# Altium project S7CAS-PLEIADES-CARTE-MERE_Pxx.PrjPcb (part 3 of 5)

## Sheet S7CAS-PLEIADES-CARTE-MERE_Pxx_CAN.SchDoc
size Tabloid; SheetNumber: 12; SheetTotal: 18; Sheet_Name: CAN; Size: 11x17
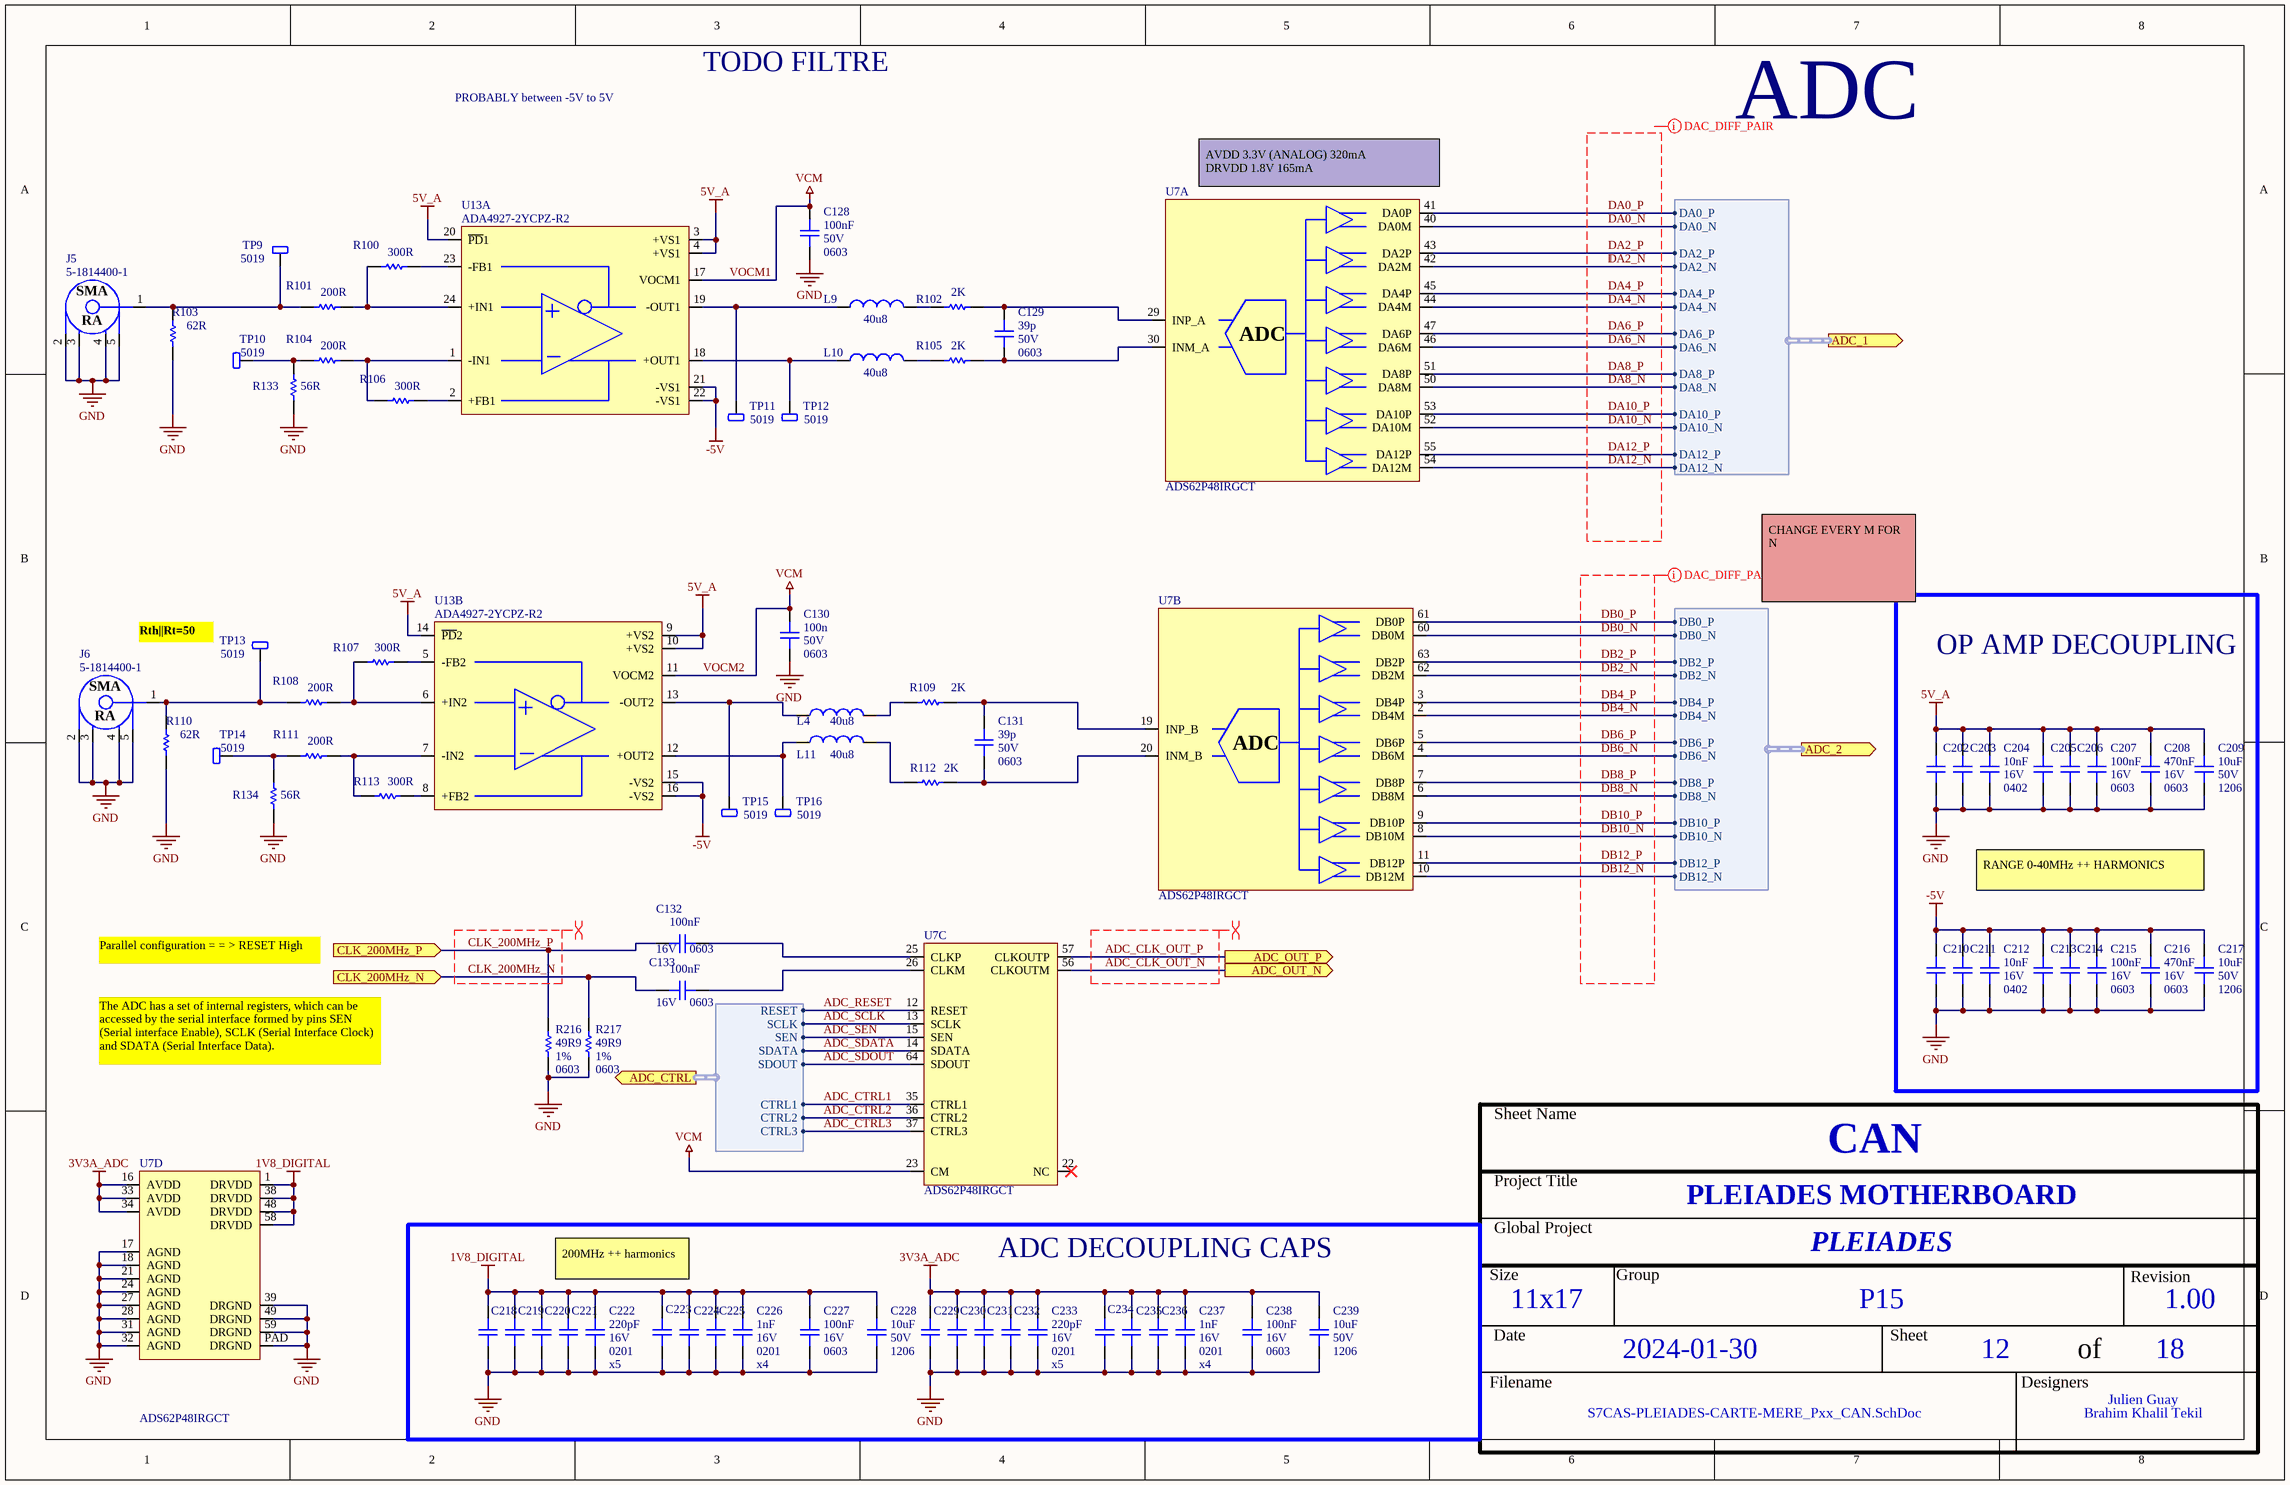
[diagram p10: S7CAS-PLEIADES-CARTE-MERE_Pxx_CAN.SchDoc]

### Parts
C128  value 100nF  Voltage: 50V  Package: 0603  [CAP_0603]  (hidden comment: CAP - 0603)
C129  value 39p  Voltage: 50V  Package: 0603  [CAP_0603]  (hidden comment: CAP - 0603)
C130  value 100n  Voltage: 50V  Package: 0603  [CAP_0603]  (hidden comment: CAP - 0603)
C131  value 39p  Voltage: 50V  Package: 0603  [CAP_0603]  (hidden comment: CAP - 0603)
C132  value 100nF  Voltage: 16V  Package: 0603  [CAP_0603]  (hidden comment: CAP - 0603)
C133  value 100nF  Voltage: 16V  Package: 0603  [CAP_0603]  (hidden comment: CAP - 0603)
C202  CAP - 0402  [CAP_0402]  (value not drawn)
C203  CAP - 0402  [CAP_0402]  (value not drawn)
C204  value 10nF  Voltage: 16V  Package: 0402  [CAP_0402]  (hidden comment: CAP - 0402)
C205  CAP - 0603  [CAP_0603]  (value not drawn)
C206  CAP - 0603  [CAP_0603]  (value not drawn)
C207  value 100nF  Voltage: 16V  Package: 0603  [CAP_0603]  (hidden comment: CAP - 0603)
C208  value 470nF  Voltage: 16V  Package: 0603  [CAP_0603]  (hidden comment: CAP - 0603)
C209  value 10uF  Voltage: 50V  Package: 1206  [CAP_1206]  (hidden comment: CAP - 1206)
C210  CAP - 0402  [CAP_0402]  (value not drawn)
C211  CAP - 0402  [CAP_0402]  (value not drawn)
C212  value 10nF  Voltage: 16V  Package: 0402  [CAP_0402]  (hidden comment: CAP - 0402)
C213  CAP - 0603  [CAP_0603]  (value not drawn)
C214  CAP - 0603  [CAP_0603]  (value not drawn)
C215  value 100nF  Voltage: 16V  Package: 0603  [CAP_0603]  (hidden comment: CAP - 0603)
C216  value 470nF  Voltage: 16V  Package: 0603  [CAP_0603]  (hidden comment: CAP - 0603)
C217  value 10uF  Voltage: 50V  Package: 1206  [CAP_1206]  (hidden comment: CAP - 1206)
C218  CAP - 0201  [CAP_0201]  (value not drawn)
C219  CAP - 0201  [CAP_0201]  (value not drawn)
C220  CAP - 0201  [CAP_0201]  (value not drawn)
C221  CAP - 0201  [CAP_0201]  (value not drawn)
C222  value 220pF  Voltage: 16V  Package: 0201  [CAP_0201]  (hidden comment: CAP - 0201)
C223  CAP - 0201  [CAP_0201]  (value not drawn)
C224  CAP - 0201  [CAP_0201]  (value not drawn)
C225  CAP - 0201  [CAP_0201]  (value not drawn)
C226  value 1nF  Voltage: 16V  Package: 0201  [CAP_0201]  (hidden comment: CAP - 0201)
C227  value 100nF  Voltage: 16V  Package: 0603  [CAP_0603]  (hidden comment: CAP - 0603)
C228  value 10uF  Voltage: 50V  Package: 1206  [CAP_1206]  (hidden comment: CAP - 1206)
C229  CAP - 0201  [CAP_0201]  (value not drawn)
C230  CAP - 0201  [CAP_0201]  (value not drawn)
C231  CAP - 0201  [CAP_0201]  (value not drawn)
C232  CAP - 0201  [CAP_0201]  (value not drawn)
C233  value 220pF  Voltage: 16V  Package: 0201  [CAP_0201]  (hidden comment: CAP - 0201)
C234  CAP - 0201  [CAP_0201]  (value not drawn)
C235  CAP - 0201  [CAP_0201]  (value not drawn)
C236  CAP - 0201  [CAP_0201]  (value not drawn)
C237  value 1nF  Voltage: 16V  Package: 0201  [CAP_0201]  (hidden comment: CAP - 0201)
C238  value 100nF  Voltage: 16V  Package: 0603  [CAP_0603]  (hidden comment: CAP - 0603)
C239  value 10uF  Voltage: 50V  Package: 1206  [CAP_1206]  (hidden comment: CAP - 1206)
J5  5-1814400-1  [CONN_SMA_5-1814400-1]
J6  5-1814400-1  [CONN_SMA_5-1814400-1]
L4  value 40u8  [INDUCT_0603]  (hidden comment: INDUCTOR - 0603)
L9  value 40u8  [INDUCT_0603]  (hidden comment: INDUCTOR - 0603)
L10  value 40u8  [INDUCT_0603]  (hidden comment: INDUCTOR - 0603)
L11  value 40u8  [INDUCT_0603]  (hidden comment: INDUCTOR - 0603)
R100  value 300R  [RES_0603]  (hidden comment: RES - 0603)
R101  value 200R  [RES_0603]  (hidden comment: RES - 0603)
R102  value 2K  [RES_0603]  (hidden comment: RES - 0603)
R103  value 62R  [RES_0603]  (hidden comment: RES - 0603)
R104  value 200R  [RES_0603]  (hidden comment: RES - 0603)
R105  value 2K  [RES_0603]  (hidden comment: RES - 0603)
R106  value 300R  [RES_0603]  (hidden comment: RES - 0603)
R107  value 300R  [RES_0603]  (hidden comment: RES - 0603)
R108  value 200R  [RES_0603]  (hidden comment: RES - 0603)
R109  value 2K  [RES_0603]  (hidden comment: RES - 0603)
R110  value 62R  [RES_0603]  (hidden comment: RES - 0603)
R111  value 200R  [RES_0603]  (hidden comment: RES - 0603)
R112  value 2K  [RES_0603]  (hidden comment: RES - 0603)
R113  value 300R  [RES_0603]  (hidden comment: RES - 0603)
R133  value 56R  [RES_0603]  (hidden comment: RES - 0603)
R134  value 56R  [RES_0603]  (hidden comment: RES - 0603)
R216  value 49R9  Package: 0603  Precision: 1%  [RES_0603]  (hidden comment: RES - 0603)
R217  value 49R9  Package: 0603  Precision: 1%  [RES_0603]  (hidden comment: RES - 0603)
TP9  5019  [TPO_SMD_5019]
TP10  5019  [TPO_SMD_5019]
TP11  5019  [TPO_SMD_5019]
TP12  5019  [TPO_SMD_5019]
TP13  5019  [TPO_SMD_5019]
TP14  5019  [TPO_SMD_5019]
TP15  5019  [TPO_SMD_5019]
TP16  5019  [TPO_SMD_5019]
U7  ADS62P48IRGCT  [ADC_ADS62P48IRGCT]  (parts A,B,C,D of 4)
U13  ADA4927-2YCPZ-R2  [OPAMP_ADA4927-2YCPZ-R2]  (parts A,B of 2)

### Blocks framed on the sheet
OP AMP DECOUPLING: C202-C217
ADC DECOUPLING CAPS: C218-C239

### Ports
ADC_1 (out, harness ADC_1_HARNESS, see S7CAS-PLEIADES-CARTE-MERE_Pxx_FPGA_bank3[1A]), ADC_2 (out, harness ADC_2_HARNESS, see S7CAS-PLEIADES-CARTE-MERE_Pxx_FPGA_bank3[1B]), ADC_CTRL (out, harness ADC_CTRL_HARNESS, see S7CAS-PLEIADES-CARTE-MERE_Pxx_FPGA_bank3[2C]), ADC_OUT_N (out, see S7CAS-PLEIADES-CARTE-MERE_Pxx_FPGA_bank3[4B]), ADC_OUT_P (out, see S7CAS-PLEIADES-CARTE-MERE_Pxx_FPGA_bank3[4B]), CLK_200MHz_N (in, see S7CAS-PLEIADES-CARTE-MERE_Pxx_FLASH_PHY_CLOCK[5A]), CLK_200MHz_P (in, see S7CAS-PLEIADES-CARTE-MERE_Pxx_FLASH_PHY_CLOCK[5A])

### Harnesses
ADC_1_HARNESS: DA0_P, DA0_N, DA2_P, DA2_N, DA4_P, DA4_N, DA6_P, DA6_N, DA8_P, DA8_N, DA10_P, DA10_N, DA12_P, DA12_N
ADC_2_HARNESS: DB0_P, DB0_N, DB2_P, DB2_N, DB4_P, DB4_N, DB6_P, DB6_N, DB8_P, DB8_N, DB10_P, DB10_N, DB12_P, DB12_N
ADC_CTRL_HARNESS: RESET, SCLK, SEN, SDATA, SDOUT, CTRL1, CTRL2, CTRL3

### Nets
1V8_DIGITAL: C218.2 C219.2 C220.2 C221.2 C222.2 C223.2 C224.2 C225.2 C226.2 C227.2 C228.2 U7.1(DRVDD) U7.38(DRVDD) U7.48(DRVDD) U7.58(DRVDD)
3V3A_ADC: C229.2 C230.2 C231.2 C232.2 C233.2 C234.2 C235.2 C236.2 C237.2 C238.2 C239.2 U7.16(AVDD) U7.33(AVDD) U7.34(AVDD)
5V_A: C202.2 C203.2 C204.2 C205.2 C206.2 C207.2 C208.2 C209.2 U13.3(+VS1) U13.4(+VS1) U13.9(+VS2) U13.10(+VS2) U13.14(~{PD}2) U13.20(~{PD}1)
-5V: C210.2 C211.2 C212.2 C213.2 C214.2 C215.2 C216.2 C217.2 U13.15(-VS2) U13.16(-VS2) U13.21(-VS1) U13.22(-VS1)
GND: C128.1 C130.1 C202.1 C203.1 C204.1 C205.1 C206.1 C207.1 C208.1 C209.1 C210.1 C211.1 C212.1 C213.1 C214.1 C215.1 C216.1 C217.1 C218.1 C219.1 C220.1 C221.1 C222.1 C223.1 C224.1 C225.1 C226.1 C227.1 C228.1 C229.1 C230.1 C231.1 C232.1 C233.1 C234.1 C235.1 C236.1 C237.1 C238.1 C239.1 J5.2 J5.3 J5.4 J5.5 J6.2 J6.3 J6.4 J6.5 R103.1 R110.1 R133.2 R134.2 R216.1 R217.1 U7.17(AGND) U7.18(AGND) U7.21(AGND) U7.24(AGND) U7.27(AGND) U7.28(AGND) U7.31(AGND) U7.32(AGND) U7.39(DRGND) U7.49(DRGND) U7.59(DRGND) U7.PAD(DRGND)  [project net nCS]
VOCM1: C128.2 C130.2 U7.23(CM) U13.11(VOCM2) U13.17(VOCM1)  [also labelled VCM, VOCM2]
: U7.42(DA2M) ; port ADC_1.DA2_N  [also labelled DA2_N]
ADC_CLK_OUT_N: U7.56(CLKOUTM) ; port ADC_OUT_N
ADC_CLK_OUT_P: U7.57(CLKOUTP) ; port ADC_OUT_P
ADC_CTRL1: U7.35(CTRL1) ; port ADC_CTRL.CTRL1
ADC_CTRL2: U7.36(CTRL2) ; port ADC_CTRL.CTRL2
ADC_CTRL3: U7.37(CTRL3) ; port ADC_CTRL.CTRL3
ADC_RESET: U7.12(RESET) ; port ADC_CTRL.RESET
ADC_SCLK: U7.13(SCLK) ; port ADC_CTRL.SCLK
ADC_SDATA: U7.14(SDATA) ; port ADC_CTRL.SDATA
ADC_SDOUT: U7.64(SDOUT) ; port ADC_CTRL.SDOUT
ADC_SEN: U7.15(SEN) ; port ADC_CTRL.SEN
CLK_200MHz_N: C133.2 R217.2 ; port CLK_200MHz_N
CLK_200MHz_P: C132.2 R216.2 ; port CLK_200MHz_P
DA0_N: U7.40(DA0M) ; port ADC_1.DA0_N
DA0_P: U7.41(DA0P) ; port ADC_1.DA0_P
DA2_P: U7.43(DA2P) ; port ADC_1.DA2_P
DA4_N: U7.44(DA4M) ; port ADC_1.DA4_N
DA4_P: U7.45(DA4P) ; port ADC_1.DA4_P
DA6_N: U7.46(DA6M) ; port ADC_1.DA6_N
DA6_P: U7.47(DA6P) ; port ADC_1.DA6_P
DA8_N: U7.50(DA8M) ; port ADC_1.DA8_N
DA8_P: U7.51(DA8P) ; port ADC_1.DA8_P
DA10_N: U7.52(DA10M) ; port ADC_1.DA10_N
DA10_P: U7.53(DA10P) ; port ADC_1.DA10_P
DA12_N: U7.54(DA12M) ; port ADC_1.DA12_N
DA12_P: U7.55(DA12P) ; port ADC_1.DA12_P
DB0_N: U7.60(DB0M) ; port ADC_2.DB0_N
DB0_P: U7.61(DB0P) ; port ADC_2.DB0_P
DB2_N: U7.62(DB2M) ; port ADC_2.DB2_N
DB2_P: U7.63(DB2P) ; port ADC_2.DB2_P
DB4_N: U7.2(DB4M) ; port ADC_2.DB4_N
DB4_P: U7.3(DB4P) ; port ADC_2.DB4_P
DB6_N: U7.4(DB6M) ; port ADC_2.DB6_N
DB6_P: U7.5(DB6P) ; port ADC_2.DB6_P
DB8_N: U7.6(DB8M) ; port ADC_2.DB8_N
DB8_P: U7.7(DB8P) ; port ADC_2.DB8_P
DB10_N: U7.8(DB10M) ; port ADC_2.DB10_N
DB10_P: U7.9(DB10P) ; port ADC_2.DB10_P
DB12_N: U7.10(DB12M) ; port ADC_2.DB12_N
DB12_P: U7.11(DB12P) ; port ADC_2.DB12_P
NetC129_1: C129.1 R105.1 U7.30(INM_A)
NetC129_2: C129.2 R102.1 U7.29(INP_A)
NetC131_1: C131.1 R112.1 U7.20(INM_B)
NetC131_2: C131.2 R109.1 U7.19(INP_B)
NetC132_1: C132.1 U7.25(CLKP)
NetC133_1: C133.1 U7.26(CLKM)
NetJ5_1: J5.1 R101.2 R103.2 TP9.1
NetJ6_1: J6.1 R108.2 R110.2 TP13.1
NetL4_1: L4.1 TP15.1 U13.13(-OUT2)
NetL4_2: L4.2 R109.2
NetL9_1: L9.1 TP11.1 U13.19(-OUT1)
NetL9_2: L9.2 R102.2
NetL10_1: L10.1 TP12.1 U13.18(+OUT1)
NetL10_2: L10.2 R105.2
NetL11_1: L11.1 TP16.1 U13.12(+OUT2)
NetL11_2: L11.2 R112.2
NetR100_1: R100.1 U13.23(-FB1)
NetR100_2: R100.2 R101.1 U13.24(+IN1)
NetR104_1: R104.1 R106.2 U13.1(-IN1)
NetR104_2: R104.2 R133.1 TP10.1
NetR106_1: R106.1 U13.2(+FB1)
NetR107_1: R107.1 U13.5(-FB2)
NetR107_2: R107.2 R108.1 U13.6(+IN2)
NetR111_1: R111.1 R113.2 U13.7(-IN2)
NetR111_2: R111.2 R134.1 TP14.1
NetR113_1: R113.1 U13.8(+FB2)

Not connected (* = marked no-connect by the designer): U7 22(NC)*

### Layout directives
differential pair: (no net found under the mark), ADC_CLK_OUT_N, ADC_CLK_OUT_P, CLK_200MHz_N, CLK_200MHz_P, DB0_N, DB0_P, DB2_N, DB2_P, DB4_N, DB4_P, DB6_N, DB6_P, DB8_N, DB8_P, DB10_N, DB10_P, DB12_N, DB12_P

### Notes on the sheet
- TODO FILTRE
- PROBABLY between -5V to 5V
- ADC
- (near U7) AVDD 3.3V (ANALOG) 320mA
  DRVDD 1.8V 165mA
- CHANGE EVERY M FOR N
- Rth||Rt=50
- RANGE 0-40MHz ++ HARMONICS
- Parallel configuration = = > RESET High
- The ADC has a set of internal registers, which can be accessed by the serial interface formed by pins SEN
  (Serial interface Enable), SCLK (Serial Interface Clock) and SDATA (Serial Interface Data).
- 200MHz ++ harmonics
- (near C222) x5
- (near C226) x4
- (near C233) x5
- (near C237) x4
- Sheet Name
- Project Title
- Global Project
- Size
- Group
- Revision
- Date
- Sheet
- of
- Filename
- Designers
- (in symbol ADC_ADS62P48IRGCT, part A) ADC
- (in symbol ADC_ADS62P48IRGCT, part B) ADC
- (in symbol CONN_SMA_5-1814400-1) SMA; RA

### Library data of the parts
C128-C133 C207 C208 C215 C216 C227 C238 = CAP - 0603: Precision: 10%; Current: *; CreatedBy: Jonathan Bouchard; Power: *
  C132 C133 C207 C215 C227 C238: Supplier 1: Arrow Electronics; Supplier Part Number 1: CL10B104KO8NNNC
  C208 C216: Supplier 1: Arrow Electronics; Supplier Part Number 1: C1608X7R1C474K080AC
C202 C203 C210 C211 = CAP - 0402: Precision: 10%; Voltage: 16V; Value: 10nF; Current: *; CreatedBy: Jonathan Bouchard; Power: *; Package: 0402; Supplier 1: Arrow Electronics; Supplier Part Number 1: GRM155R61A224KE19D
C204 C212 = CAP - 0402: Precision: 10%; Current: *; CreatedBy: Jonathan Bouchard; Power: *; Supplier 1: Arrow Electronics; Supplier Part Number 1: GRM155R61A224KE19D
C205 C206 C213 C214 = CAP - 0603: Precision: 10%; Voltage: 16V; Value: 100nF; Current: *; CreatedBy: Jonathan Bouchard; Power: *; Package: 0603; Supplier 1: Arrow Electronics; Supplier Part Number 1: CL10B104KO8NNNC
C209 C217 C228 C239 = CAP - 1206: Precision: 10%; Current: *; CreatedBy: Jonathan Bouchard; Power: *; Supplier 1: Avnet; Supplier Part Number 1: CL31A106MBHNNNE
C218-C221 C229-C232 = CAP - 0201: Precision: 10%; Voltage: 16V; Value: 220pF; Current: *; CreatedBy: Jonathan Bouchard; Power: *; Package: 0201; Supplier 1: Arrow Electronics; Supplier Part Number 1: GRM033R71C221KA01D
C222 C226 C233 C237 = CAP - 0201: Precision: 10%; Current: *; CreatedBy: Jonathan Bouchard; Power: *
  C222 C233: Supplier 1: Arrow Electronics; Supplier Part Number 1: GRM033R71C221KA01D
  C226 C237: Supplier 1: Avnet; Supplier Part Number 1: GRM033R71C102KA01J
C223-C225 C234-C236 = CAP - 0201: Precision: 10%; Voltage: 16V; Value: 1nF; Current: *; CreatedBy: Jonathan Bouchard; Power: *; Package: 0201; Supplier 1: Avnet; Supplier Part Number 1: GRM033R71C102KA01J
J5 J6 = CONN_SMA_5-1814400-1: CONN -  SMA JACK R/A 50 OHM - TH; Mfg: TE Connectivity AMP Connectors; Voltage: *; Current: *; Power: *; Mfg Part Number: 5-1814400-1; HelpURL: http://www.te.com/commerce/DocumentDelivery/DDEController?Action=srchrtrv&DocNm=1814400&DocType=Customer+Drawing&DocLang=English; CreatedBy: Jonathan Bouchard; Temperature: -55°C ~ 85°C; Value: *; Precision: *; Package: TH-5; Supplier 1: Digikey; Supplier Part Number 1: A97593-ND
L4 L9-L11 = INDUCT - 0603: GRAMS Lib Spec: 2.7; Saturation Val: *
TP9-TP16 = TPO_SMD_5019: TPO - PC TEST POINT MINI - SMD; Manufacturer #1: Keystone Electronics; Value: 3.81mm x 2.03mm; Polarized: No; Magnetic Material: UNKNOWN; GRAMS Lib Spec: 2.8; Current Rating: *; Manufacturer #2: *; Note: *; Power Max: *; Part Number #2: *; HelpURL: https://www.digikey.ca/product-detail/en/keystone-electronics/5019/36-5019CT-ND/3907344; Supplier 1: Digi-Key; Supplier Part Number 1: 36-5019CT-ND; Assembly Type: SMD; Part Number #1: 5019; Package: SMD; CreatedBy/Date: Olivier Bernard / 5/12/2017; Temperature: *; Tolerance: *; VerifiedBy: Caroline Paulin / 5 juillet 2018; Voltage Rating: *; Cryo: UNKNOWN
U7 = ADC_ADS62P48IRGCT: ADC - 14 BIT 210MSPS SUAL - VQFN-64; Voltage: 3.15 V ~ 3.6 V / 1.7 V ~ 1.9 V; Mfg: Texas Instruments; Precision: 14 Bit; Current: *; Power: *; Mfg Part Number: ADS62P48IRGCT; HelpURL: http://www.ti.com/lit/ds/symlink/ads62p48.pdf; CreatedBy: Jonathan Bouchard; Temperature: -40°C ~ 85°C; Value: *; Package: VQFN-64; Supplier 1: Digikey; Supplier Part Number 1: 296-24611-1-ND
U13 = OPAMP_ADA4927-2YCPZ-R2: OPAMP - CFA 2.3GHZ - QFN-24; Voltage: 4.5 V ~ 11 V, ±2.25 V ~ 5.5 V; Current: 65mA; Mfg: Analog Devices; Power: *; Mfg Part Number: ADA4927-2YCPZ-R2; HelpURL: http://www.analog.com/media/en/technical-documentation/data-sheets/ADA4927-1_4927-2.pdf; CreatedBy: Jonathan Bouchard; Temperature: -40°C ~ 105°C; Value: *; Precision: *; Package: QFN-24; Supplier 1: Digikey; Supplier Part Number 1: ADA4927-2YCPZ-R2CT-ND
R100-R113 R133 R134 R216 R217 = RES - 0603: Current: *; CreatedBy: Jonathan Bouchard
  R216 R217: Supplier 1: Mouser; Supplier Part Number 1: 667-ERJ-3EKF49R9V

## Sheet S7CAS-PLEIADES-CARTE-MERE_Pxx_MOTEUR.SchDoc
size Tabloid; SheetNumber: 13; SheetTotal: 18; Sheet_Name: MOTEUR; Size: 11x17
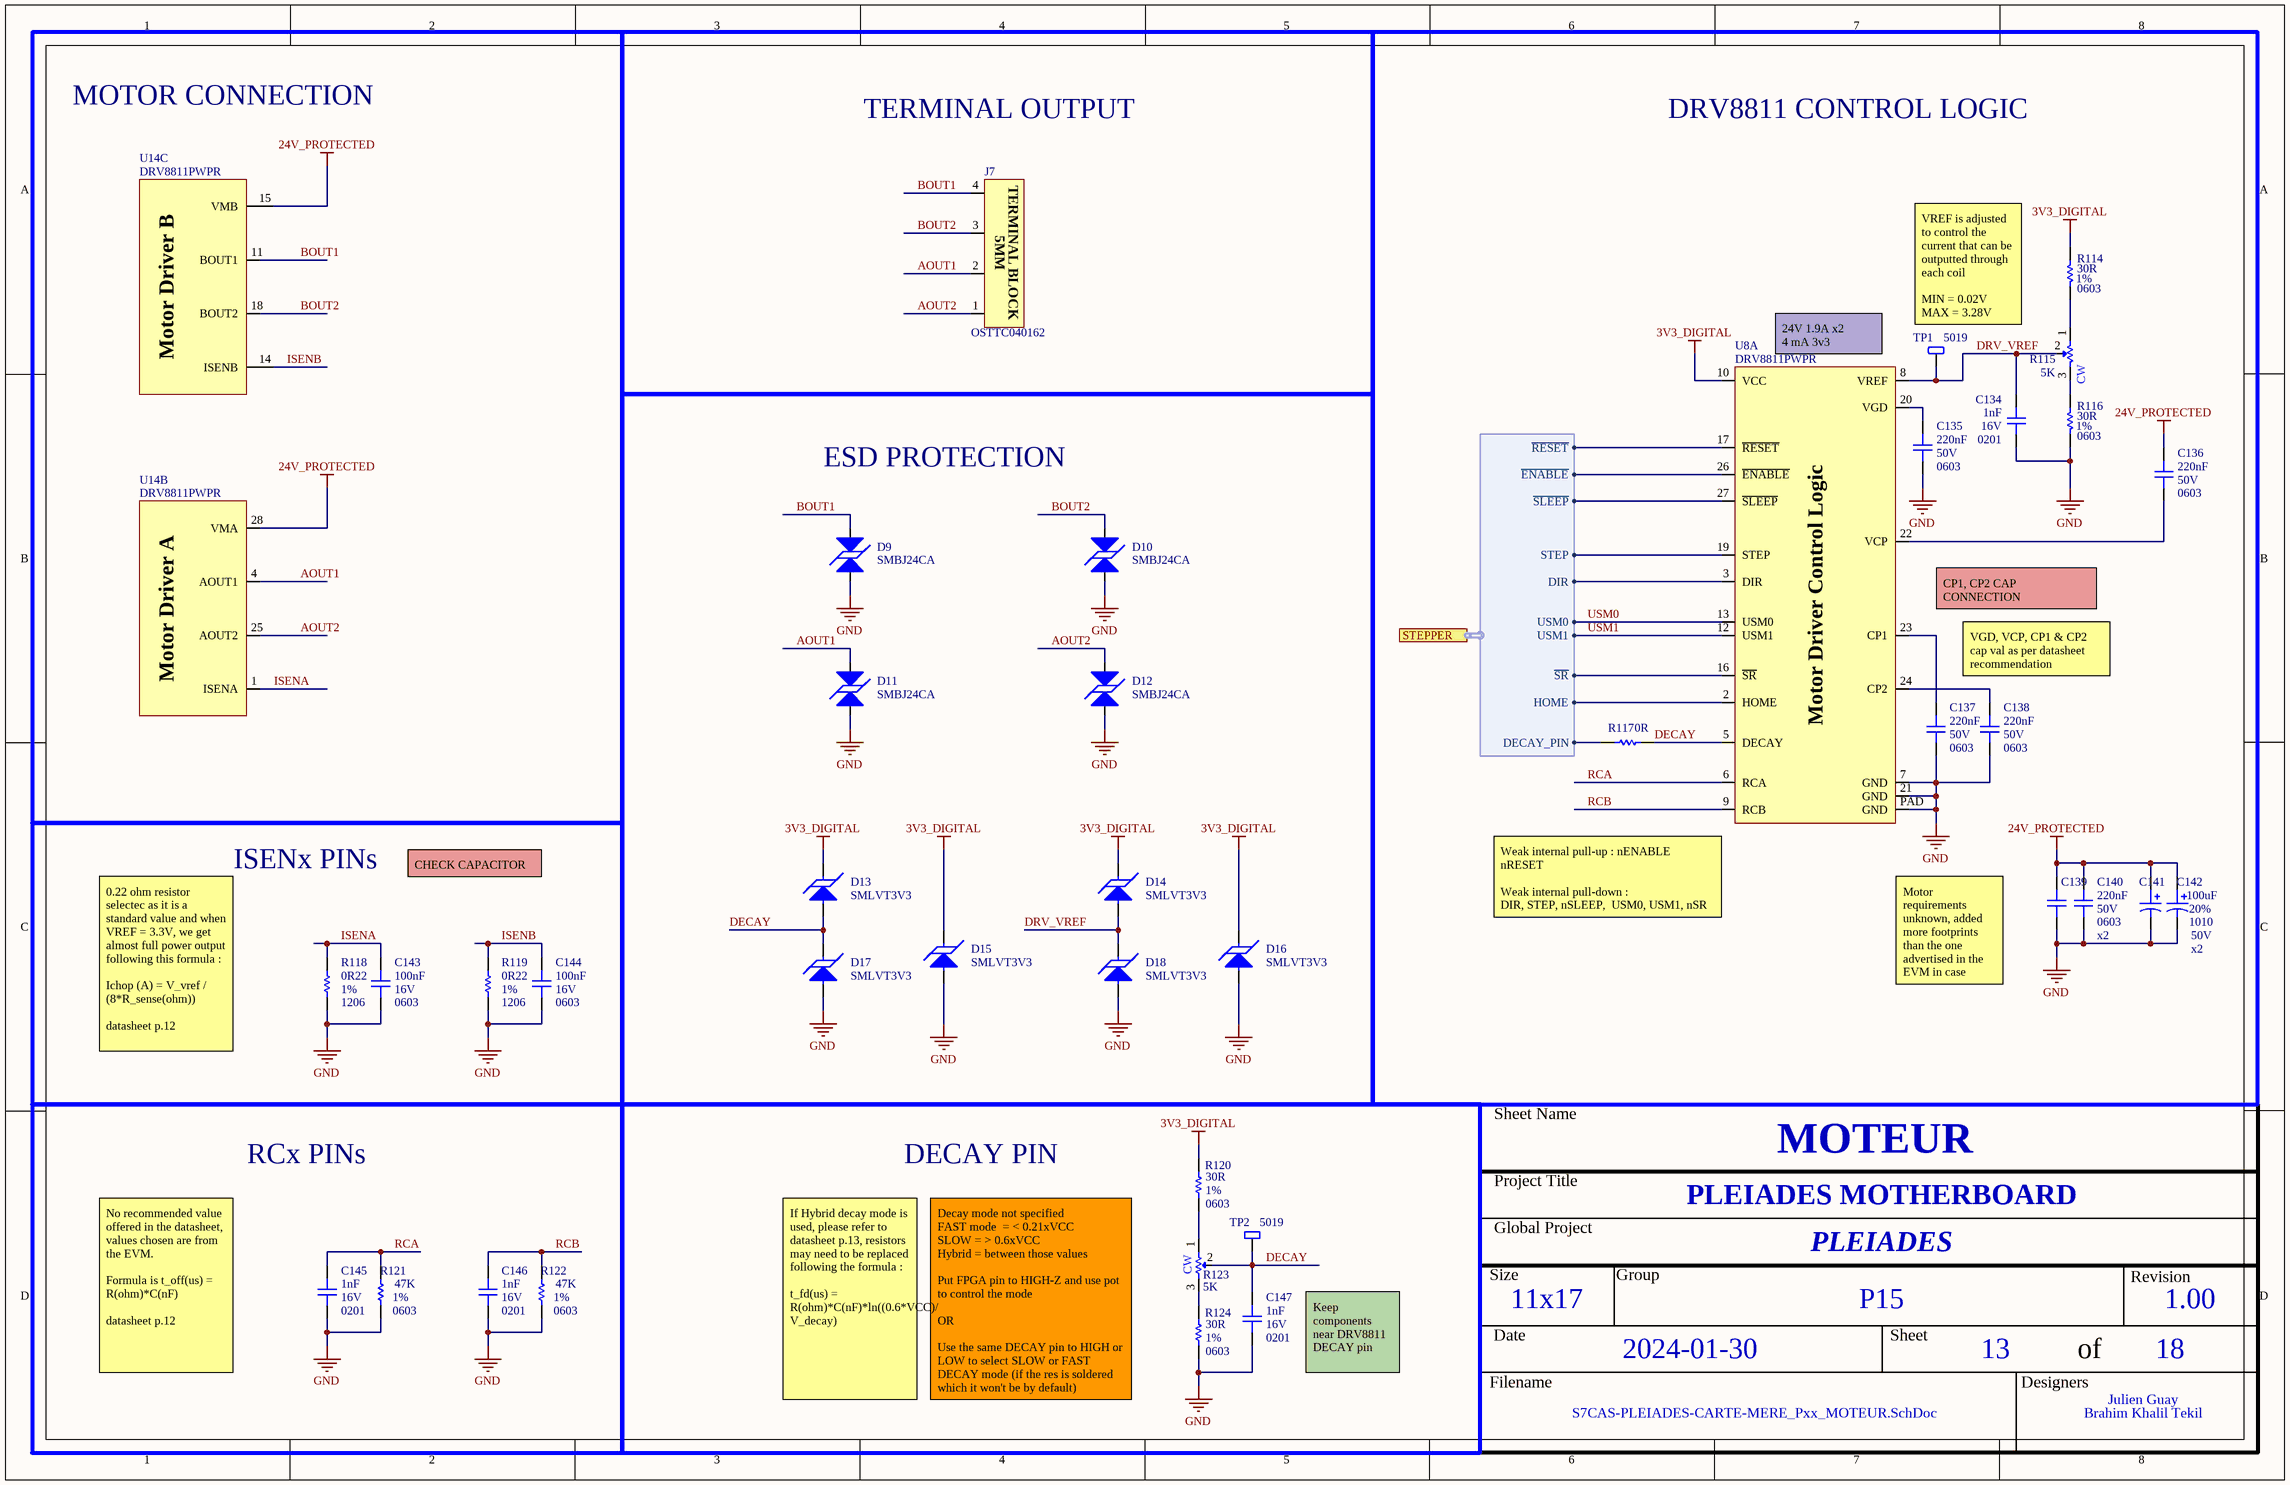
[diagram p11: S7CAS-PLEIADES-CARTE-MERE_Pxx_MOTEUR.SchDoc]

### Parts
C134  value 1nF  Voltage: 16V  Package: 0201  [CAP_0201]  (hidden comment: CAP - 0201)
C135  value 220nF  Voltage: 50V  Package: 0603  [CAP_0603]  (hidden comment: CAP - 0603)
C136  value 220nF  Voltage: 50V  Package: 0603  [CAP_0603]  (hidden comment: CAP - 0603)
C137  value 220nF  Voltage: 50V  Package: 0603  [CAP_0603]  (hidden comment: CAP - 0603)
C138  value 220nF  Voltage: 50V  Package: 0603  [CAP_0603]  (hidden comment: CAP - 0603)
C139  CAP - 0603  [CAP_0603]  (value not drawn)
C140  value 220nF  Voltage: 50V  Package: 0603  [CAP_0603]  (hidden comment: CAP - 0603)
C141  MAL215099101E3  [CAP_ALU_1010_vishay]  (value not drawn)
C142  value 100uF  Voltage: 50V  Package: 1010  Precision: 20%  [CAP_ALU_1010_vishay]  (hidden comment: MAL215099101E3)
C143  value 100nF  Voltage: 16V  Package: 0603  [CAP_0603]  (hidden comment: CAP - 0603)
C144  value 100nF  Voltage: 16V  Package: 0603  [CAP_0603]  (hidden comment: CAP - 0603)
C145  value 1nF  Voltage: 16V  Package: 0201  [CAP_0201]  (hidden comment: CAP - 0201)
C146  value 1nF  Voltage: 16V  Package: 0201  [CAP_0201]  (hidden comment: CAP - 0201)
C147  value 1nF  Voltage: 16V  Package: 0201  [CAP_0201]  (hidden comment: CAP - 0201)
D9  SMBJ24CA  [TVS_PWR_SMBJ36CA]
D10  SMBJ24CA  [TVS_PWR_SMBJ36CA]
D11  SMBJ24CA  [TVS_PWR_SMBJ36CA]
D12  SMBJ24CA  [TVS_PWR_SMBJ36CA]
D13  SMLVT3V3  [TVS_POW_SMLVT3V3]
D14  SMLVT3V3  [TVS_POW_SMLVT3V3]
D15  SMLVT3V3  [TVS_POW_SMLVT3V3]
D16  SMLVT3V3  [TVS_POW_SMLVT3V3]
D17  SMLVT3V3  [TVS_POW_SMLVT3V3]
D18  SMLVT3V3  [TVS_POW_SMLVT3V3]
J7  OSTTC040162  [CONN_TERMINAL_OSTTA040161]
R114  value 30R  Package: 0603  Precision: 1%  [RES_0603]  (hidden comment: RES - 0603)
R115  value 5K  [POT_J_LEAD_TOP]  (hidden comment: Part Number)
R116  value 30R  Package: 0603  Precision: 1%  [RES_0603]  (hidden comment: RES - 0603)
R117  value 0R  [RES_0603]  (hidden comment: RES - 0603)
R118  value 0R22  Package: 1206  Precision: 1%  [RES_1206]  (hidden comment: RES - 1206)
R119  value 0R22  Package: 1206  Precision: 1%  [RES_1206]  (hidden comment: RES - 1206)
R120  value 30R  Package: 0603  Precision: 1%  [RES_0603]  (hidden comment: RES - 0603)
R121  value 47K  Package: 0603  Precision: 1%  [RES_0603]  (hidden comment: RES - 0603)
R122  value 47K  Package: 0603  Precision: 1%  [RES_0603]  (hidden comment: RES - 0603)
R123  value 5K  [POT_J_LEAD_TOP]  (hidden comment: Part Number)
R124  value 30R  Package: 0603  Precision: 1%  [RES_0603]  (hidden comment: RES - 0603)
TP1  5019  [TPO_SMD_5019]
TP2  5019  [TPO_SMD_5019]
U8  DRV8811PWPR  [POW_MOTOR_DRV8811PWPR]  (part A of 3)
U14  DRV8811PWPR  [POW_MOTOR_DRV8811PWPR]  (parts B,C of 3)

### Blocks framed on the sheet
MOTOR CONNECTION: U14
TERMINAL OUTPUT: J7
DRV8811 CONTROL LOGIC: C134-C142 R114-R117 TP1 U8
ESD PROTECTION: D9-D18
ISENx PINs: C143 C144 R118 R119
RCx PINs: C145 C146 R121 R122
DECAY PIN: C147 R120 R123 R124 TP2

### Ports
STEPPER (harness STEPPER_MOTOR_DRIVER_HARNESS, see S7CAS-PLEIADES-CARTE-MERE_Pxx_FPGA_bank0_1_5[1A])

### Harnesses
STEPPER_MOTOR_DRIVER_HARNESS: ~{RESET}, ~{ENABLE}, ~{SLEEP}, STEP, DIR, USM0, USM1, ~{SR}, HOME, DECAY_PIN

### Nets
3V3_DIGITAL: D13.K D14.K D15.K D16.K R114.1 R120.1 U8.10(VCC)
24V_PROTECTED: C136.2 C139.2 C140.2 C141.1 C142.1 U14.15(VMB) U14.28(VMA)
GND: C134.1 C135.1 C137.1 C138.1 C139.1 C140.1 C141.2 C142.2 C143.1 C144.1 C145.1 C146.1 C147.1 D9.2 D10.2 D11.2 D12.2 D15.A D16.A D17.A D18.A R116.2 R118.1 R119.1 R121.1 R122.1 R124.2 U8.7(GND) U8.21(GND) U8.PAD(GND)  [project net nCS]
AOUT1: D11.1 J7.2 U14.4(AOUT1)
AOUT2: D12.1 J7.1 U14.25(AOUT2)
BOUT1: D9.1 J7.4 U14.11(BOUT1)
BOUT2: D10.1 J7.3 U14.18(BOUT2)
DECAY: C147.2 D13.A D17.K R117.1 R123.2 TP2.1 U8.5(DECAY)
DRV_VREF: C134.2 D14.A D18.K R115.2 TP1.1 U8.8(VREF)
ISENA: C143.2 R118.2 U14.1(ISENA)
ISENB: C144.2 R119.2 U14.14(ISENB)
RCA: C145.2 R121.2 U8.6(RCA)
RCB: C146.2 R122.2 U8.9(RCB)
USM0: U8.13(USM0) ; port STEPPER.USM0
USM1: U8.12(USM1) ; port STEPPER.USM1
NetC135_2: C135.2 U8.20(VGD)
NetC136_1: C136.1 U8.22(VCP)
NetC137_2: C137.2 U8.23(CP1)
NetC138_2: C138.2 U8.24(CP2)
NetR114_2: R114.2 R115.1
NetR115_3: R115.3 R116.1
NetR117_2: R117.2 ; port STEPPER.DECAY_PIN
NetR120_2: R120.2 R123.1
NetR123_3: R123.3 R124.1
NetU1_A5: U8.19(STEP) ; port STEPPER.STEP
NetU1_A6: U8.16(~{SR}) ; port STEPPER.~{SR}
NetU1_C5: U8.27(~{SLEEP}) ; port STEPPER.~{SLEEP}
NetU1_C7: U8.2(HOME) ; port STEPPER.HOME
NetU1_D5: U8.26(~{ENABLE}) ; port STEPPER.~{ENABLE}
NetU1_E6: U8.17(~{RESET}) ; port STEPPER.~{RESET}
NetU1_G8: U8.3(DIR) ; port STEPPER.DIR

### Notes on the sheet
- (near U8) 24V 1.9A x2
  4 mA 3v3
- VREF is adjusted to control the current that can be outputted through each coil
  MIN = 0.02V
  MAX = 3.28V
- (near U8) CP1, CP2 CAP CONNECTION
- VGD, VCP, CP1 & CP2 cap val as per datasheet recommendation
- CHECK CAPACITOR
- (near U8) Weak internal pull-up : nENABLE nRESET
  Weak internal pull-down :
  DIR, STEP, nSLEEP,  USM0, USM1, nSR
- (near C140) x2
- x2
- Motor requirements unknown, added more footprints than the one advertised in the EVM in case needed
- 0.22 ohm resistor selectec as it is a standard value and when VREF = 3.3V, we get almost full power output following this formula :
  Ichop (A) = V_vref / (8*R_sense(ohm))
  datasheet p.12
- No recommended value offered in the datasheet, values chosen are from the EVM.
  Formula is t_off(us) = R(ohm)*C(nF)
  datasheet p.12
- Keep components near DRV8811 DECAY pin
- If Hybrid decay mode is used, please refer to datasheet p.13, resistors may need to be replaced following the formula :
  t_fd(us) = R(ohm)*C(nF)*ln((0.6*VCC)/ V_decay)
- Decay mode not specified
  FAST mode  = < 0.21xVCC
  SLOW = > 0.6xVCC
  Hybrid = between those values
  Put FPGA pin to HIGH-Z and use pot to control the mode
  OR
  Use the same DECAY pin to HIGH or LOW to select SLOW or FAST DECAY mode (if the res is soldered which it won't be by default)
- Sheet Name
- Project Title
- Global Project
- Size
- Group
- Revision
- Date
- Sheet
- of
- Filename
- Designers
- (in symbol CONN_TERMINAL_OSTTC040162) 5MM; TERMINAL BLOCK
- (in symbol POT - TOP ADJ) CW
- (in symbol POW_MOTOR_DRV8811PWPR, part A) Motor Driver Control Logic
- (in symbol POW_MOTOR_DRV8811PWPR, part B) Motor Driver A
- (in symbol POW_MOTOR_DRV8811PWPR, part C) Motor Driver B

### Library data of the parts
C134 C145-C147 = CAP - 0201: Precision: 10%; Current: *; CreatedBy: Jonathan Bouchard; Power: *; Supplier 1: Avnet; Supplier Part Number 1: GRM033R71C102KA01J
C135-C138 C140 C143 C144 = CAP - 0603: Precision: 10%; Current: *; CreatedBy: Jonathan Bouchard; Power: *
  C135-C138 C140: Supplier 1: Arrow Electronic; Supplier Part Number 1: GRM188R71H224KAC4D
  C143 C144: Supplier 1: Arrow Electronics; Supplier Part Number 1: CL10B104KO8NNNC
C139 = CAP - 0603: Precision: 10%; Voltage: 50V; Value: 220nF; Current: *; CreatedBy: Jonathan Bouchard; Power: *; Package: 0603; Supplier 1: Arrow Electronic; Supplier Part Number 1: GRM188R71H224KAC4D
C141 C142 = CAP_ALU_MAL215099101E3: CAP - ALU 100uF 20% 50V - 1010; Current: 490mA; Mfg: Vishay Dale; Mfg Part Number: MAL215099101E3; HelpURL: http://www.vishay.com/docs/28395/150crz.pdf; CreatedBy: Jonathan Bouchard; Temperature: -55°C to 125°C; Power: *; Supplier 1: Digikey; Supplier Part Number 1: 4399PHDKR-ND
  C141: Voltage: 50V; Package: 1010; Precision: 20%; Value: 100uF
D9-D12 = TVS_PWR_SMBJ24CA: TVS - 24V 26.7V 600W - DO214AA; Manufacturer #1: Littelfuse Inc.; Value: Vbr = 26.7V -  Clamp = 38.9V; Voltage Rating: 24V Standoff; Current Rating: 15.5A; GRAMS Lib Spec: 2.8; Magnetic Material: UNKNOWN; Polarized: NO; Tolerance: *; Power Max: 600W; HelpURL: http://www.littelfuse.com/~/media/electronics/datasheets/tvs_diodes/littelfuse_tvs_diode_smbj_datasheet.pdf.pdf; CreatedBy/Date: Arnaud Samson - 06/07/18; VerifiedBy: Jonathan Bouchard - 2018-07-13; Temperature: -65°C ~ 150°C (TJ); Package: DO214AA; Manufacturer #2: *; Note: *; Assembly Type: SMD; Part Number #2: *; Part Number #1: SMBJ24CA; Supplier 1: Digi-Key; Supplier Part Number 1: SMBJ24CALFCT-ND; Cryo: UNKNOWN
D13-D18 = TVS_POW_SMLVT3V3: TVS - 3.3V 10.3V 600W - DO214AA; Manufacturer #1: STMicroelectronics; Value: Vbr = 4.1V -  Clamp = 10.3V; Voltage Rating: 3.3V Standoff; Current Rating: 200A (Ifsm); Power Max: 600W (Ppp); GRAMS Lib Spec: 2.8; Magnetic Material: UNKNOWN; Polarized: YES; Tolerance: *; HelpURL: https://www.st.com/content/ccc/resource/technical/document/datasheet/da/a4/86/90/17/13/47/7c/CD00000923.pdf/files/CD00000923.pdf/jcr:content/translations/en.CD00000923.pdf; CreatedBy/Date: Jonathan Bouchard - 2019-04-27; VerifiedBy: Nicolas V. (2019-05-06); Temperature: -55°C ~ 175°C (TJ); Package: DO214AA; Manufacturer #2: *; Note: *; Assembly Type: SMD; Part Number #2: *; Part Number #1: SMLVT3V3; Supplier 1: Digi-Key; Supplier Part Number 1: 497-2496-1-ND; Cryo: UNKNOWN
J7 = CONN_TERMINAL_OSTTC040162: CONN -  TERMINAL BLOCK 4POS 5MM - TH; Mfg: On Shore Technology Inc.; Voltage: *; Current: *; Power: *; Mfg Part Number: OSTTC040162; HelpURL: http://www.on-shore.com/wp-content/uploads/2015/09/osttcxx0162.pdf; CreatedBy: Jonathan Bouchard; Temperature: -30°C ~ 105°C; Value: *; Precision: *; Package: TH-4; Supplier 1: Digikey; Supplier Part Number 1: ED2602-ND
R115 R123 = POT - TOP ADJ: POT - 0.1W, 1/10W Surface Mount Trimmer Potentiometer Cermet 1.0 Turn Top Adjustment; GRAMS Lib Spec: 2.7
R117 = RES - 0603: Precision: 1%; Current: *; CreatedBy: Jonathan Bouchard; Package: 0603; Supplier 1: Arrow Electronics; Supplier Part Number 1: RMCF0603ZT0R00
TP1 TP2 = TPO_SMD_5019: as TP9 on sheet S7CAS-PLEIADES-CARTE-MERE_Pxx_CAN; Current Rating: *; Manufacturer #2: *; Note: *; Power Max: *; Part Number #2: *; HelpURL: https://www.digikey.ca/product-detail/en/keystone-electronics/5019/36-5019CT-ND/3907344; Supplier 1: Digi-Key; Supplier Part Number 1: 36-5019CT-ND; Assembly Type: SMD; Part Number #1: 5019; Package: SMD; CreatedBy/Date: Olivier Bernard / 5/12/2017; Temperature: *; Tolerance: *; VerifiedBy: Caroline Paulin / 5 juillet 2018; Voltage Rating: *; Cryo: UNKNOWN
U8 U14 = POW_MOTOR_DRV8811PWPR: POW - STEPPER MOTOR DRIVER - SOP-28; Voltage: 3 V ~ 5.5 V / 8 V ~ 38 V; Mfg: Texas Instrument; Current: *; Power: *; Mfg Part Number: DRV8811PWPR; HelpURL: http://www.ti.com/lit/ds/symlink/drv8811.pdf; CreatedBy: Jonathan Bouchard; Temperature: -40°C ~ 150°C (TJ); Value: *; Precision: *; Package: SOP-28; Supplier 1: Digikey; Supplier Part Number 1: 296-24591-1-ND
R114 R116 R120-R122 R124 = RES - 0603: Current: *; CreatedBy: Jonathan Bouchard; Supplier 1: Arrow Electronics
  R114 R116 R120 R124: Supplier Part Number 1: RMCF0603FT30R0
  R121 R122: Supplier Part Number 1: RMCF0603FT47K0
R118 R119 = RES - 1206: Current: *; CreatedBy: Jonathan Bouchard; Supplier 1: Mouser; Supplier Part Number 1: 667-ERJ-8RQFR22V

## Sheet S7CAS-PLEIADES-CARTE-MERE_Pxx_IO_SENSOR.SchDoc
size Tabloid; SheetNumber: 14; SheetTotal: 18; Sheet_Name: BTN, LED, TEMP SENSOR; Size: 11x17
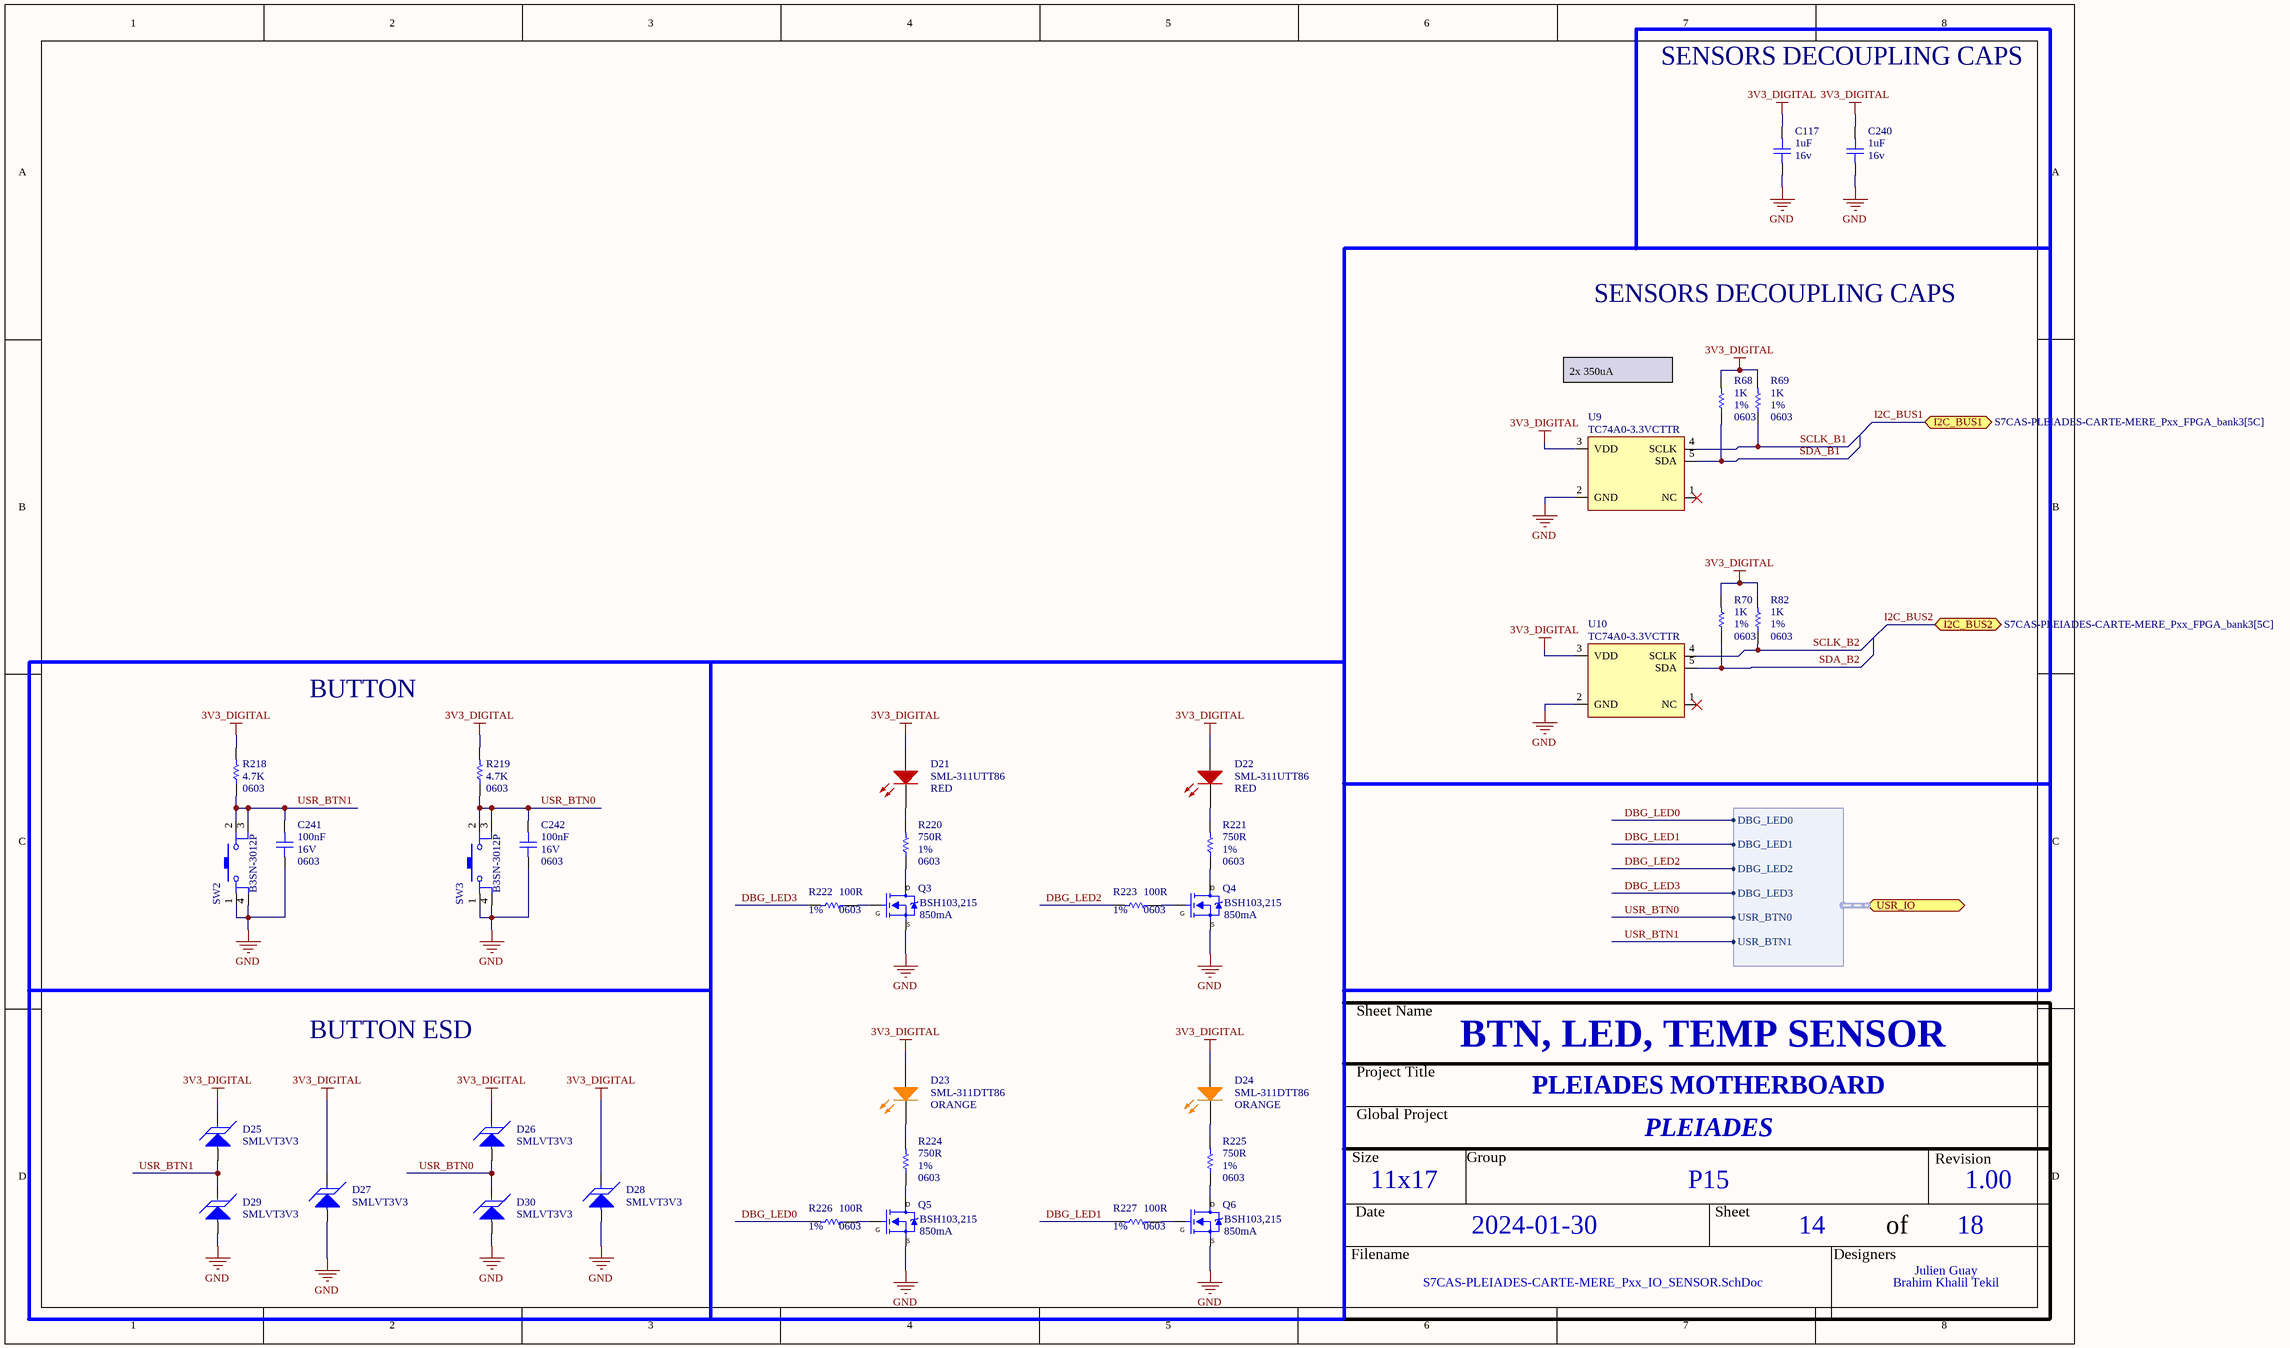
[diagram p12: S7CAS-PLEIADES-CARTE-MERE_Pxx_IO_SENSOR.SchDoc]

### Parts
C117  value 1uF  Voltage: 16v  [CAP_0603]  (hidden comment: CAP - 0603)
C240  value 1uF  Voltage: 16v  [CAP_0603]  (hidden comment: CAP - 0603)
C241  value 100nF  Voltage: 16V  Package: 0603  [CAP_0603]  (hidden comment: CAP - 0603)
C242  value 100nF  Voltage: 16V  Package: 0603  [CAP_0603]  (hidden comment: CAP - 0603)
D21  SML-311UTT86  value RED  [LED_0603]
D22  SML-311UTT86  value RED  [LED_0603]
D23  SML-311DTT86  value ORANGE  [LED_0603]
D24  SML-311DTT86  value ORANGE  [LED_0603]
D25  SMLVT3V3  [TVS_POW_SMLVT3V3]
D26  SMLVT3V3  [TVS_POW_SMLVT3V3]
D27  SMLVT3V3  [TVS_POW_SMLVT3V3]
D28  SMLVT3V3  [TVS_POW_SMLVT3V3]
D29  SMLVT3V3  [TVS_POW_SMLVT3V3]
D30  SMLVT3V3  [TVS_POW_SMLVT3V3]
Q3  BSH103,215  Current: 850mA  [SOT23-3]
Q4  BSH103,215  Current: 850mA  [SOT23-3]
Q5  BSH103,215  Current: 850mA  [SOT23-3]
Q6  BSH103,215  Current: 850mA  [SOT23-3]
R68  value 1K  Package: 0603  Precision: 1%  [RES_0603]  (hidden comment: RES - 0603)
R69  value 1K  Package: 0603  Precision: 1%  [RES_0603]  (hidden comment: RES - 0603)
R70  value 1K  Package: 0603  Precision: 1%  [RES_0603]  (hidden comment: RES - 0603)
R82  value 1K  Package: 0603  Precision: 1%  [RES_0603]  (hidden comment: RES - 0603)
R218  value 4.7K  Package: 0603  [RES_0603]  (hidden comment: RES - 0603)
R219  value 4.7K  Package: 0603  [RES_0603]  (hidden comment: RES - 0603)
R220  value 750R  Package: 0603  Precision: 1%  [RES_0603]  (hidden comment: RES - 0603)
R221  value 750R  Package: 0603  Precision: 1%  [RES_0603]  (hidden comment: RES - 0603)
R222  value 100R  Package: 0603  Precision: 1%  [RES_0603]  (hidden comment: RES - 0603)
R223  value 100R  Package: 0603  Precision: 1%  [RES_0603]  (hidden comment: RES - 0603)
R224  value 750R  Package: 0603  Precision: 1%  [RES_0603]  (hidden comment: RES - 0603)
R225  value 750R  Package: 0603  Precision: 1%  [RES_0603]  (hidden comment: RES - 0603)
R226  value 100R  Package: 0603  Precision: 1%  [RES_0603]  (hidden comment: RES - 0603)
R227  value 100R  Package: 0603  Precision: 1%  [RES_0603]  (hidden comment: RES - 0603)
SW2  B3SN-3012P  [SWI_TACT_B3SN-3012P]
SW3  B3SN-3012P  [SWI_TACT_B3SN-3012P]
U9  TC74A0-3.3VCTTR  [SEN_TEMP_TC74A0-3.3VCTTR]
U10  TC74A0-3.3VCTTR  [SEN_TEMP_TC74A0-3.3VCTTR]

### Blocks framed on the sheet
SENSORS DECOUPLING CAPS: C117 C240
SENSORS DECOUPLING CAPS: R68-R70 R82 U9 U10
BUTTON: C241 C242 R218 R219 SW2 SW3
BUTTON ESD: D25-D30

### Ports
I2C_BUS1 (bidir, see S7CAS-PLEIADES-CARTE-MERE_Pxx_FPGA_bank3[5C]), I2C_BUS2 (bidir, see S7CAS-PLEIADES-CARTE-MERE_Pxx_FPGA_bank3[5C]), USR_IO (bidir, harness USER_IOS_HARNESS, see S7CAS-PLEIADES-CARTE-MERE_Pxx_FPGA_bank3[5C])

### Harnesses
USER_IOS_HARNESS: DBG_LED0, DBG_LED1, DBG_LED2, DBG_LED3, USR_BTN0, USR_BTN1

### Nets
3V3_DIGITAL: C117.2 C240.2 D21.A D22.A D23.A D24.A D25.K D26.K D27.K D28.K R68.2 R69.2 R70.2 R82.2 R218.2 R219.2 U9.3(VDD) U10.3(VDD)
GND: C117.1 C240.1 C241.1 C242.1 D27.A D28.A D29.A D30.A Q3.2 Q4.2 Q5.2 Q6.2 SW2.1 SW2.4 SW3.1 SW3.4 U9.2(GND) U10.2(GND)  [project net nCS]
DBG_LED0: R226.2 ; port USR_IO.DBG_LED0
DBG_LED1: R227.2 ; port USR_IO.DBG_LED1
DBG_LED2: R223.2 ; port USR_IO.DBG_LED2
DBG_LED3: R222.2 ; port USR_IO.DBG_LED3
SCLK_B1: R69.1 U9.4(SCLK)
SCLK_B2: R82.1 U10.4(SCLK)
SDA_B1: R68.1 U9.5(SDA)
SDA_B2: R70.1 U10.5(SDA)
USR_BTN0: C242.2 D26.A D30.K R219.1 SW3.2 SW3.3 ; port USR_IO.USR_BTN0
USR_BTN1: C241.2 D25.A D29.K R218.1 SW2.2 SW2.3 ; port USR_IO.USR_BTN1
NetD21_K: D21.K R220.2
NetD22_K: D22.K R221.2
NetD23_K: D23.K R224.2
NetD24_K: D24.K R225.2
NetQ3_1: Q3.1 R222.1
NetQ3_3: Q3.3 R220.1
NetQ4_1: Q4.1 R223.1
NetQ4_3: Q4.3 R221.1
NetQ5_1: Q5.1 R226.1
NetQ5_3: Q5.3 R224.1
NetQ6_1: Q6.1 R227.1
NetQ6_3: Q6.3 R225.1

Not connected (* = marked no-connect by the designer): U9 1(NC)*; U10 1(NC)*

### Buses and harness runs
bus I2C_BUS1 = port I2C_BUS1
bus I2C_BUS2 = port I2C_BUS2

### Notes on the sheet
- 2x 350uA
- Sheet Name
- Project Title
- Global Project
- Size
- Group
- Revision
- Date
- Sheet
- of
- Filename
- Designers
- (in symbol MOS_N_CHANNEL) D; G; S

### Library data of the parts
C117 C240-C242 = CAP - 0603: Precision: 10%; Current: *; CreatedBy: Jonathan Bouchard; Power: *; Supplier 1: Arrow Electronics
  C117 C240: Package: 0603; Supplier Part Number 1: CL10B105MO8NNWC
  C241 C242: Supplier Part Number 1: CL10B104KO8NNNC
D21 D22 = LED_SML-311UTT86: LED - 620nM RED 2mA - 0603; Voltage: 1.8V; Mfg: ROHM Semiconductor; Power: 44mW; Current: 2mA; HelpURL: http://media.digikey.com/pdf/Data%20Sheets/Rohm%20PDFs/SML-311%20Series.pdf; CreatedBy: Jonathan Bouchard; Temperature: -30°C to 85°C; Package: 0603; Precision: *; Mfg Part Number: SML-311UTT86; Supplier 1: Digikey; Supplier Part Number 1: 511-1304-1-ND
D23 D24 = LED_SML-311DTT86: LED - 611nM ORANGE 2mA - 0603; Voltage: 1.8V; Mfg: ROHM Semiconductor; Power: 44mW; Current: 2mA; HelpURL: http://media.digikey.com/pdf/Data%20Sheets/Rohm%20PDFs/SML-311%20Series.pdf; CreatedBy: Jonathan Bouchard; Temperature: -40°C to 85°C; Package: 0603; Precision: *; Mfg Part Number: SML-311DTT86; Supplier 1: Digikey; Supplier Part Number 1: 511-1303-1-ND
D25-D30 = TVS_POW_SMLVT3V3: TVS - 3.3V 10.3V 600W - DO214AA; Manufacturer #1: STMicroelectronics; Value: Vbr = 4.1V -  Clamp = 10.3V; Voltage Rating: 3.3V Standoff; Current Rating: 200A (Ifsm); Power Max: 600W (Ppp); GRAMS Lib Spec: 2.8; Magnetic Material: UNKNOWN; Polarized: YES; Tolerance: *; HelpURL: https://www.st.com/content/ccc/resource/technical/document/datasheet/da/a4/86/90/17/13/47/7c/CD00000923.pdf/files/CD00000923.pdf/jcr:content/translations/en.CD00000923.pdf; CreatedBy/Date: Jonathan Bouchard - 2019-04-27; VerifiedBy: Nicolas V. (2019-05-06); Temperature: -55°C ~ 175°C (TJ); Package: DO214AA; Manufacturer #2: *; Note: *; Assembly Type: SMD; Part Number #2: *; Part Number #1: SMLVT3V3; Supplier 1: Digi-Key; Supplier Part Number 1: 497-2496-1-ND; Cryo: UNKNOWN
Q3-Q6 = MOS_N_CHANNEL: N-Channel  Enhancement Mode Field Effect Transistor; Mfr: *; Package / Case: *; Vds: *; Rds ON: *; Vgs: *; Operating Temperature: *; Supplier 1: Avnet; Supplier Part Number 1: BSH103,215
R218 R219 = RES - 0603: Precision: 1%; Current: *; CreatedBy: Jonathan Bouchard; Supplier 1: Arrow Electronics; Supplier Part Number 1: RMCF0603FT4K70
SW2 SW3 = SWI_TACT_B3SN-3012P: SWI - TACT SPST-NO 0.05A 24V - 4-SMD; Current: 50mA; Mfg: Omron; Mfg Part Number: B3SN-3012P; HelpURL: http://www.omron.com/ecb/products/pdf/en-b3sn.pdf; CreatedBy: Jonathan Bouchard; Temperature: -25°C ~ 70°C; Power: *; Precision: *; Package: 4-SMD; Value: *; Voltage: 24V; Supplier 1: Digikey; Supplier Part Number 1: SW261CT-ND
U9 U10 = SENS_TEMP_TC74A0-3.3VCTTR: SENS - TEMPERATURE SENSOR I2C/SMBUS - SOT23-5; Voltage: 2.7 V ~ 5.5 V; Mfg: Microchip; Precision: ±2°C (±3°C); Current: *; Power: *; Mfg Part Number: TC74A0-3.3VCTTR; HelpURL: http://ww1.microchip.com/downloads/en/DeviceDoc/21462D.pdf; CreatedBy: Jonathan Bouchard; Temperature: -40°C ~ 125°C; Value: *; Package: SOT23-5; Supplier 1: Digikey; Supplier Part Number 1: TC74A0-3.3VCTDKR-ND
R68-R70 R82 R220-R227 = RES - 0603: Current: *; CreatedBy: Jonathan Bouchard
  R220 R221 R224 R225: Supplier 1: Arrow Electronics; Supplier Part Number 1: RMCF0603FT750R
  R222 R223 R226 R227: Supplier 1: Arrow Electronics; Supplier Part Number 1: RMCF0603FT100R